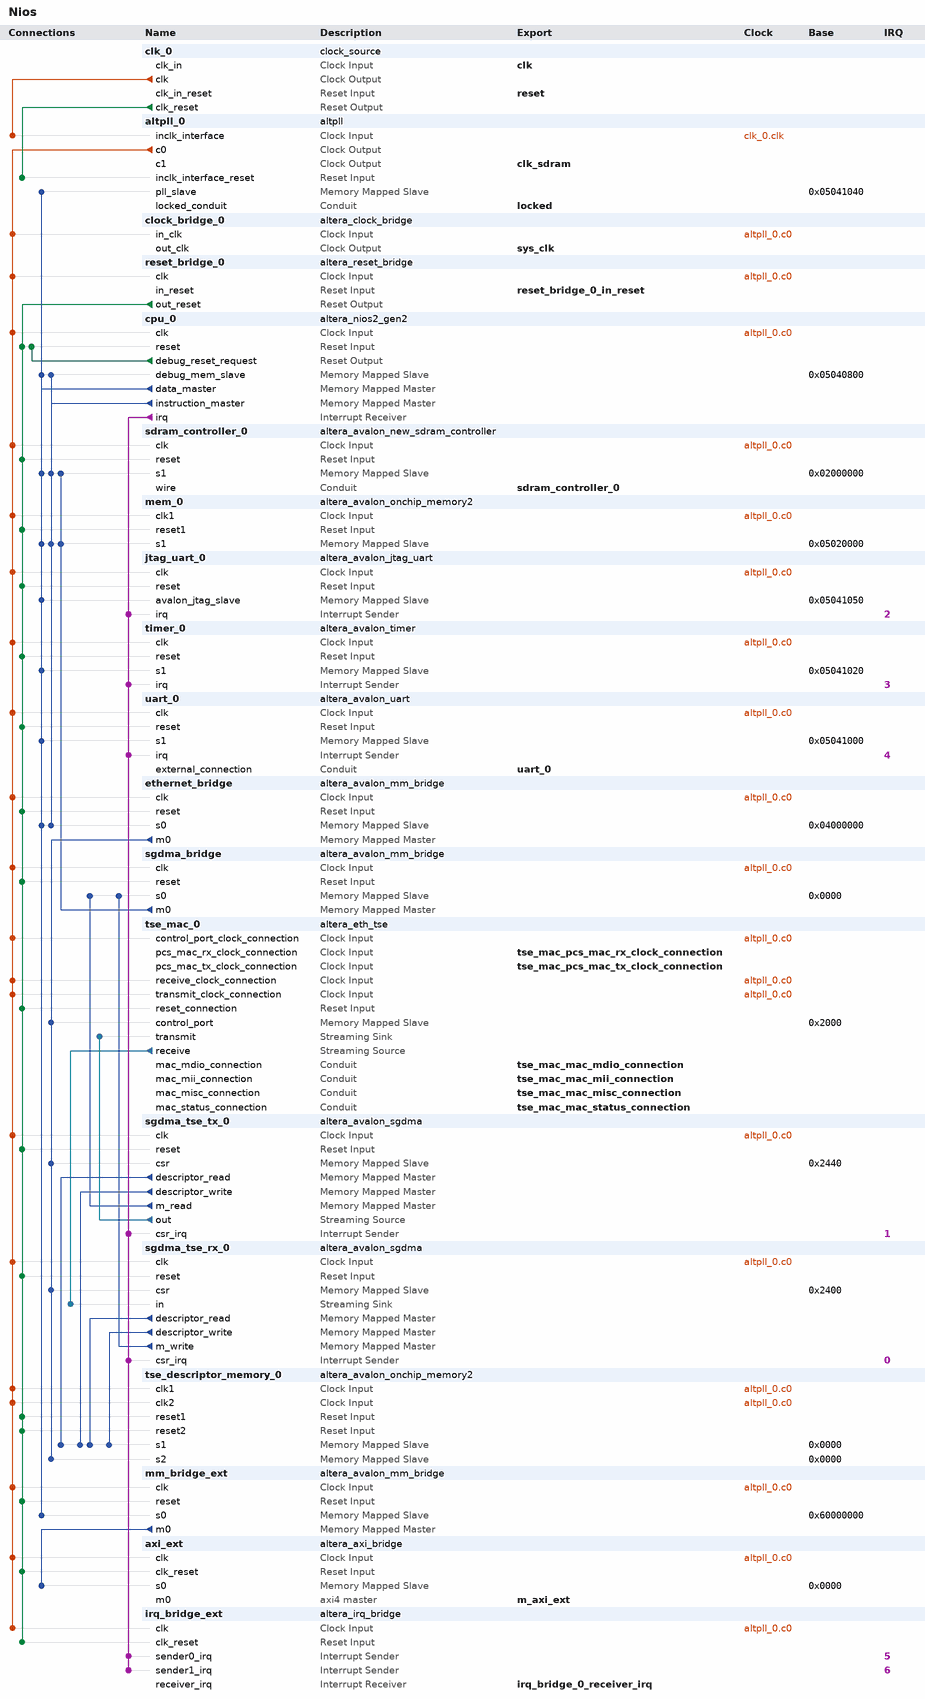
[diagram p0: system contents]
# Platform Designer (Qsys) system Nios, Cyclone 10 LP 10CL055YU484C8G
# Parameters at their usual value, and those the tool derives, are not listed.
package require -exact qsys 18.1
create_system Nios
set_project_property DEVICE_FAMILY {Cyclone 10 LP}
set_project_property DEVICE 10CL055YU484C8G

add_instance clk_0 clock_source 18.1
set_instance_parameter_value clk_0 clockFrequency 25000000

add_instance altpll_0 altpll 18.1
set_instance_parameter_value altpll_0 CLK0_DIVIDE_BY 1
set_instance_parameter_value altpll_0 CLK0_MULTIPLY_BY 4
set_instance_parameter_value altpll_0 CLK1_DIVIDE_BY 1
set_instance_parameter_value altpll_0 CLK1_DUTY_CYCLE 50
set_instance_parameter_value altpll_0 CLK1_MULTIPLY_BY 4
set_instance_parameter_value altpll_0 CLK1_PHASE_SHIFT -1500
set_instance_parameter_value altpll_0 CLK2_DIVIDE_BY 1
set_instance_parameter_value altpll_0 CLK2_DUTY_CYCLE 50
set_instance_parameter_value altpll_0 CLK2_MULTIPLY_BY 12
set_instance_parameter_value altpll_0 CLK2_PHASE_SHIFT 0
set_instance_parameter_value altpll_0 CLK3_DIVIDE_BY 1
set_instance_parameter_value altpll_0 CLK3_DUTY_CYCLE 50
set_instance_parameter_value altpll_0 CLK3_MULTIPLY_BY 2
set_instance_parameter_value altpll_0 CLK3_PHASE_SHIFT 0
set_instance_parameter_value altpll_0 INCLK0_INPUT_FREQUENCY 40000
set_instance_parameter_value altpll_0 PORT_ARESET PORT_UNUSED
set_instance_parameter_value altpll_0 PORT_LOCKED PORT_USED
set_instance_parameter_value altpll_0 PORT_clk1 PORT_USED
set_instance_parameter_value altpll_0 PORT_clk2 PORT_UNUSED
set_instance_parameter_value altpll_0 PORT_clk3 PORT_UNUSED

add_instance clock_bridge_0 altera_clock_bridge 18.1
set_instance_parameter_value clock_bridge_0 DERIVED_CLOCK_RATE 100000000
set_instance_parameter_value clock_bridge_0 EXPLICIT_CLOCK_RATE 0

add_instance reset_bridge_0 altera_reset_bridge 18.1
set_instance_parameter_value reset_bridge_0 ACTIVE_LOW_RESET 1
set_instance_parameter_value reset_bridge_0 SYNCHRONOUS_EDGES deassert

add_instance cpu_0 altera_nios2_gen2 18.1
set_instance_parameter_value cpu_0 dcache_size 0
set_instance_parameter_value cpu_0 debug_datatrigger 4
set_instance_parameter_value cpu_0 debug_hwbreakpoint 4
set_instance_parameter_value cpu_0 debug_traceType instruction_and_data_trace
set_instance_parameter_value cpu_0 exceptionSlave sdram_controller_0.s1
set_instance_parameter_value cpu_0 icache_size 16384
set_instance_parameter_value cpu_0 impl Fast
set_instance_parameter_value cpu_0 resetSlave sdram_controller_0.s1
set_instance_parameter_value cpu_0 setting_preciseIllegalMemAccessException true
set_instance_parameter_value cpu_0 setting_support31bitdcachebypass false

add_instance sdram_controller_0 altera_avalon_new_sdram_controller 18.1
set_instance_parameter_value sdram_controller_0 TAC 8.0
set_instance_parameter_value sdram_controller_0 TRCD 30.0
set_instance_parameter_value sdram_controller_0 TRFC 90.0
set_instance_parameter_value sdram_controller_0 TRP 30.0
set_instance_parameter_value sdram_controller_0 TWR 30.0
set_instance_parameter_value sdram_controller_0 casLatency 2
set_instance_parameter_value sdram_controller_0 columnWidth 9
set_instance_parameter_value sdram_controller_0 dataWidth 16
set_instance_parameter_value sdram_controller_0 generateSimulationModel false
set_instance_parameter_value sdram_controller_0 initRefreshCommands 8
set_instance_parameter_value sdram_controller_0 model single_Micron_MT48LC4M32B2_7_chip
set_instance_parameter_value sdram_controller_0 numberOfBanks 4
set_instance_parameter_value sdram_controller_0 numberOfChipSelects 1
set_instance_parameter_value sdram_controller_0 powerUpDelay 200.0
set_instance_parameter_value sdram_controller_0 refreshPeriod 7.8125
set_instance_parameter_value sdram_controller_0 rowWidth 13

add_instance mem_0 altera_avalon_onchip_memory2 18.1
set_instance_parameter_value mem_0 dataWidth 32
set_instance_parameter_value mem_0 dualPort false
set_instance_parameter_value mem_0 initMemContent true
set_instance_parameter_value mem_0 initializationFileName onchip_mem.hex
set_instance_parameter_value mem_0 memorySize 131072

add_instance jtag_uart_0 altera_avalon_jtag_uart 18.1
set_instance_parameter_value jtag_uart_0 simInteractiveOptions NO_INTERACTIVE_WINDOWS

add_instance timer_0 altera_avalon_timer 18.1
set_instance_parameter_value timer_0 period 1
set_instance_parameter_value timer_0 periodUnits MSEC

add_instance uart_0 altera_avalon_uart 18.1
set_instance_parameter_value uart_0 baud 115200
set_instance_parameter_value uart_0 dataBits 8
set_instance_parameter_value uart_0 fixedBaud true
set_instance_parameter_value uart_0 parity NONE
set_instance_parameter_value uart_0 stopBits 1

add_instance ethernet_bridge altera_avalon_mm_bridge 18.1
set_instance_parameter_value ethernet_bridge ADDRESS_UNITS SYMBOLS
set_instance_parameter_value ethernet_bridge ADDRESS_WIDTH 13
set_instance_parameter_value ethernet_bridge DATA_WIDTH 32
set_instance_parameter_value ethernet_bridge MAX_PENDING_RESPONSES 4
set_instance_parameter_value ethernet_bridge USE_AUTO_ADDRESS_WIDTH 1

add_instance sgdma_bridge altera_avalon_mm_bridge 18.1
set_instance_parameter_value sgdma_bridge ADDRESS_UNITS SYMBOLS
set_instance_parameter_value sgdma_bridge ADDRESS_WIDTH 26
set_instance_parameter_value sgdma_bridge DATA_WIDTH 32
set_instance_parameter_value sgdma_bridge MAX_PENDING_RESPONSES 4
set_instance_parameter_value sgdma_bridge USE_AUTO_ADDRESS_WIDTH 1

add_instance tse_mac_0 altera_eth_tse 18.1
set_instance_parameter_value tse_mac_0 XCVR_RCFG_JTAG_ENABLE 0
set_instance_parameter_value tse_mac_0 XCVR_SET_CAPABILITY_REG_ENABLE 0
set_instance_parameter_value tse_mac_0 XCVR_SET_CSR_SOFT_LOGIC_ENABLE 0
set_instance_parameter_value tse_mac_0 XCVR_SET_PRBS_SOFT_LOGIC_ENABLE 0
set_instance_parameter_value tse_mac_0 XCVR_SET_USER_IDENTIFIER 0
set_instance_parameter_value tse_mac_0 core_variation SMALL_MAC_10_100
set_instance_parameter_value tse_mac_0 eg_addr 12
set_instance_parameter_value tse_mac_0 enable_hd_logic true
set_instance_parameter_value tse_mac_0 enable_mac_flow_ctrl false
set_instance_parameter_value tse_mac_0 enable_magic_detect false
set_instance_parameter_value tse_mac_0 enable_shift16 true
set_instance_parameter_value tse_mac_0 ifGMII MII
set_instance_parameter_value tse_mac_0 ing_addr 12
set_instance_parameter_value tse_mac_0 mdio_clk_div 30
set_instance_parameter_value tse_mac_0 stat_cnt_ena false
set_instance_parameter_value tse_mac_0 transceiver_type NONE

add_instance sgdma_tse_tx_0 altera_avalon_sgdma 18.1
set_instance_parameter_value sgdma_tse_tx_0 enableBurstTransfers false
set_instance_parameter_value sgdma_tse_tx_0 enableUnalignedTransfers true
set_instance_parameter_value sgdma_tse_tx_0 readBlockDataWidth 32
set_instance_parameter_value sgdma_tse_tx_0 sinkErrorWidth 0
set_instance_parameter_value sgdma_tse_tx_0 sourceErrorWidth 1
set_instance_parameter_value sgdma_tse_tx_0 transferMode MEMORY_TO_STREAM
set_instance_parameter_value sgdma_tse_tx_0 writeBurstcountWidth 4

add_instance sgdma_tse_rx_0 altera_avalon_sgdma 18.1
set_instance_parameter_value sgdma_tse_rx_0 enableBurstTransfers false
set_instance_parameter_value sgdma_tse_rx_0 enableUnalignedTransfers false
set_instance_parameter_value sgdma_tse_rx_0 readBlockDataWidth 32
set_instance_parameter_value sgdma_tse_rx_0 sinkErrorWidth 6
set_instance_parameter_value sgdma_tse_rx_0 sourceErrorWidth 0
set_instance_parameter_value sgdma_tse_rx_0 transferMode STREAM_TO_MEMORY
set_instance_parameter_value sgdma_tse_rx_0 writeBurstcountWidth 4

add_instance tse_descriptor_memory_0 altera_avalon_onchip_memory2 18.1
set_instance_parameter_value tse_descriptor_memory_0 dataWidth 32
set_instance_parameter_value tse_descriptor_memory_0 dualPort true
set_instance_parameter_value tse_descriptor_memory_0 initMemContent true
set_instance_parameter_value tse_descriptor_memory_0 initializationFileName onchip_mem.hex
set_instance_parameter_value tse_descriptor_memory_0 memorySize 8192

add_instance mm_bridge_ext altera_avalon_mm_bridge 18.1
set_instance_parameter_value mm_bridge_ext ADDRESS_UNITS SYMBOLS
set_instance_parameter_value mm_bridge_ext ADDRESS_WIDTH 32
set_instance_parameter_value mm_bridge_ext DATA_WIDTH 32
set_instance_parameter_value mm_bridge_ext MAX_PENDING_RESPONSES 4
set_instance_parameter_value mm_bridge_ext USE_AUTO_ADDRESS_WIDTH 1

add_instance axi_ext altera_axi_bridge 18.1
set_instance_parameter_value axi_ext ADDR_WIDTH 28
set_instance_parameter_value axi_ext AXI_VERSION AXI4
set_instance_parameter_value axi_ext COMBINED_ACCEPTANCE_CAPABILITY 16
set_instance_parameter_value axi_ext COMBINED_ISSUING_CAPABILITY 16
set_instance_parameter_value axi_ext DATA_WIDTH 32
set_instance_parameter_value axi_ext M0_ID_WIDTH 18
set_instance_parameter_value axi_ext READ_ACCEPTANCE_CAPABILITY 16
set_instance_parameter_value axi_ext READ_ADDR_USER_WIDTH 32
set_instance_parameter_value axi_ext READ_DATA_REORDERING_DEPTH 1
set_instance_parameter_value axi_ext READ_DATA_USER_WIDTH 32
set_instance_parameter_value axi_ext READ_ISSUING_CAPABILITY 16
set_instance_parameter_value axi_ext S0_ID_WIDTH 8
set_instance_parameter_value axi_ext USE_M0_ARBURST 0
set_instance_parameter_value axi_ext USE_M0_ARCACHE 0
set_instance_parameter_value axi_ext USE_M0_ARID 0
set_instance_parameter_value axi_ext USE_M0_ARLEN 0
set_instance_parameter_value axi_ext USE_M0_ARLOCK 0
set_instance_parameter_value axi_ext USE_M0_ARQOS 0
set_instance_parameter_value axi_ext USE_M0_ARREGION 0
set_instance_parameter_value axi_ext USE_M0_ARSIZE 0
set_instance_parameter_value axi_ext USE_M0_ARUSER 0
set_instance_parameter_value axi_ext USE_M0_AWBURST 0
set_instance_parameter_value axi_ext USE_M0_AWCACHE 0
set_instance_parameter_value axi_ext USE_M0_AWID 0
set_instance_parameter_value axi_ext USE_M0_AWLEN 0
set_instance_parameter_value axi_ext USE_M0_AWLOCK 0
set_instance_parameter_value axi_ext USE_M0_AWQOS 0
set_instance_parameter_value axi_ext USE_M0_AWREGION 0
set_instance_parameter_value axi_ext USE_M0_AWSIZE 0
set_instance_parameter_value axi_ext USE_M0_AWUSER 0
set_instance_parameter_value axi_ext USE_M0_BID 0
set_instance_parameter_value axi_ext USE_M0_BRESP 1
set_instance_parameter_value axi_ext USE_M0_BUSER 0
set_instance_parameter_value axi_ext USE_M0_RID 0
set_instance_parameter_value axi_ext USE_M0_RLAST 0
set_instance_parameter_value axi_ext USE_M0_RRESP 1
set_instance_parameter_value axi_ext USE_M0_RUSER 0
set_instance_parameter_value axi_ext USE_M0_WSTRB 1
set_instance_parameter_value axi_ext USE_M0_WUSER 0
set_instance_parameter_value axi_ext USE_PIPELINE 1
set_instance_parameter_value axi_ext USE_S0_ARCACHE 0
set_instance_parameter_value axi_ext USE_S0_ARLOCK 0
set_instance_parameter_value axi_ext USE_S0_ARPROT 0
set_instance_parameter_value axi_ext USE_S0_ARQOS 0
set_instance_parameter_value axi_ext USE_S0_ARREGION 0
set_instance_parameter_value axi_ext USE_S0_ARUSER 0
set_instance_parameter_value axi_ext USE_S0_AWCACHE 0
set_instance_parameter_value axi_ext USE_S0_AWLOCK 0
set_instance_parameter_value axi_ext USE_S0_AWPROT 0
set_instance_parameter_value axi_ext USE_S0_AWQOS 0
set_instance_parameter_value axi_ext USE_S0_AWREGION 0
set_instance_parameter_value axi_ext USE_S0_AWUSER 0
set_instance_parameter_value axi_ext USE_S0_BRESP 1
set_instance_parameter_value axi_ext USE_S0_BUSER 0
set_instance_parameter_value axi_ext USE_S0_RRESP 1
set_instance_parameter_value axi_ext USE_S0_RUSER 0
set_instance_parameter_value axi_ext USE_S0_WLAST 0
set_instance_parameter_value axi_ext USE_S0_WUSER 0
set_instance_parameter_value axi_ext WRITE_ACCEPTANCE_CAPABILITY 16
set_instance_parameter_value axi_ext WRITE_ADDR_USER_WIDTH 32
set_instance_parameter_value axi_ext WRITE_DATA_USER_WIDTH 32
set_instance_parameter_value axi_ext WRITE_ISSUING_CAPABILITY 16
set_instance_parameter_value axi_ext WRITE_RESP_USER_WIDTH 32

add_instance irq_bridge_ext altera_irq_bridge 18.1
set_instance_parameter_value irq_bridge_ext IRQ_WIDTH 2

# connections
add_connection altpll_0.c0 axi_ext.clk clock
add_connection altpll_0.c0 clock_bridge_0.in_clk clock
add_connection altpll_0.c0 cpu_0.clk clock
add_connection altpll_0.c0 ethernet_bridge.clk clock
add_connection altpll_0.c0 irq_bridge_ext.clk clock
add_connection altpll_0.c0 jtag_uart_0.clk clock
add_connection altpll_0.c0 mem_0.clk1 clock
add_connection altpll_0.c0 mm_bridge_ext.clk clock
add_connection altpll_0.c0 reset_bridge_0.clk clock
add_connection altpll_0.c0 sdram_controller_0.clk clock
add_connection altpll_0.c0 sgdma_bridge.clk clock
add_connection altpll_0.c0 sgdma_tse_rx_0.clk clock
add_connection altpll_0.c0 sgdma_tse_tx_0.clk clock
add_connection altpll_0.c0 timer_0.clk clock
add_connection altpll_0.c0 tse_descriptor_memory_0.clk1 clock
add_connection altpll_0.c0 tse_descriptor_memory_0.clk2 clock
add_connection altpll_0.c0 tse_mac_0.control_port_clock_connection clock
add_connection altpll_0.c0 tse_mac_0.receive_clock_connection clock
add_connection altpll_0.c0 tse_mac_0.transmit_clock_connection clock
add_connection altpll_0.c0 uart_0.clk clock
add_connection clk_0.clk altpll_0.inclk_interface clock
add_connection clk_0.clk_reset altpll_0.inclk_interface_reset reset
add_connection cpu_0.debug_reset_request cpu_0.reset reset
add_connection reset_bridge_0.out_reset axi_ext.clk_reset reset
add_connection reset_bridge_0.out_reset cpu_0.reset reset
add_connection reset_bridge_0.out_reset ethernet_bridge.reset reset
add_connection reset_bridge_0.out_reset irq_bridge_ext.clk_reset reset
add_connection reset_bridge_0.out_reset jtag_uart_0.reset reset
add_connection reset_bridge_0.out_reset mem_0.reset1 reset
add_connection reset_bridge_0.out_reset mm_bridge_ext.reset reset
add_connection reset_bridge_0.out_reset sdram_controller_0.reset reset
add_connection reset_bridge_0.out_reset sgdma_bridge.reset reset
add_connection reset_bridge_0.out_reset sgdma_tse_rx_0.reset reset
add_connection reset_bridge_0.out_reset sgdma_tse_tx_0.reset reset
add_connection reset_bridge_0.out_reset timer_0.reset reset
add_connection reset_bridge_0.out_reset tse_descriptor_memory_0.reset1 reset
add_connection reset_bridge_0.out_reset tse_descriptor_memory_0.reset2 reset
add_connection reset_bridge_0.out_reset tse_mac_0.reset_connection reset
add_connection reset_bridge_0.out_reset uart_0.reset reset
add_connection cpu_0.data_master altpll_0.pll_slave avalon
set_connection_parameter_value cpu_0.data_master/altpll_0.pll_slave baseAddress 0x05041040
add_connection cpu_0.data_master cpu_0.debug_mem_slave avalon
set_connection_parameter_value cpu_0.data_master/cpu_0.debug_mem_slave baseAddress 0x05040800
add_connection cpu_0.data_master ethernet_bridge.s0 avalon
set_connection_parameter_value cpu_0.data_master/ethernet_bridge.s0 baseAddress 0x04000000
add_connection cpu_0.data_master jtag_uart_0.avalon_jtag_slave avalon
set_connection_parameter_value cpu_0.data_master/jtag_uart_0.avalon_jtag_slave baseAddress 0x05041050
add_connection cpu_0.data_master mem_0.s1 avalon
set_connection_parameter_value cpu_0.data_master/mem_0.s1 baseAddress 0x05020000
add_connection cpu_0.data_master mm_bridge_ext.s0 avalon
set_connection_parameter_value cpu_0.data_master/mm_bridge_ext.s0 baseAddress 0x60000000
add_connection cpu_0.data_master sdram_controller_0.s1 avalon
set_connection_parameter_value cpu_0.data_master/sdram_controller_0.s1 baseAddress 0x02000000
add_connection cpu_0.data_master timer_0.s1 avalon
set_connection_parameter_value cpu_0.data_master/timer_0.s1 baseAddress 0x05041020
add_connection cpu_0.data_master uart_0.s1 avalon
set_connection_parameter_value cpu_0.data_master/uart_0.s1 baseAddress 0x05041000
add_connection cpu_0.instruction_master cpu_0.debug_mem_slave avalon
set_connection_parameter_value cpu_0.instruction_master/cpu_0.debug_mem_slave baseAddress 0x05040800
add_connection cpu_0.instruction_master ethernet_bridge.s0 avalon
set_connection_parameter_value cpu_0.instruction_master/ethernet_bridge.s0 baseAddress 0x04000000
add_connection cpu_0.instruction_master mem_0.s1 avalon
set_connection_parameter_value cpu_0.instruction_master/mem_0.s1 baseAddress 0x05020000
add_connection cpu_0.instruction_master sdram_controller_0.s1 avalon
set_connection_parameter_value cpu_0.instruction_master/sdram_controller_0.s1 baseAddress 0x02000000
add_connection ethernet_bridge.m0 sgdma_tse_rx_0.csr avalon
set_connection_parameter_value ethernet_bridge.m0/sgdma_tse_rx_0.csr baseAddress 0x2400
add_connection ethernet_bridge.m0 sgdma_tse_tx_0.csr avalon
set_connection_parameter_value ethernet_bridge.m0/sgdma_tse_tx_0.csr baseAddress 0x2440
add_connection ethernet_bridge.m0 tse_descriptor_memory_0.s2 avalon
set_connection_parameter_value ethernet_bridge.m0/tse_descriptor_memory_0.s2 baseAddress 0x0000
add_connection ethernet_bridge.m0 tse_mac_0.control_port avalon
set_connection_parameter_value ethernet_bridge.m0/tse_mac_0.control_port baseAddress 0x2000
add_connection mm_bridge_ext.m0 axi_ext.s0 avalon
set_connection_parameter_value mm_bridge_ext.m0/axi_ext.s0 baseAddress 0x0000
add_connection sgdma_bridge.m0 mem_0.s1 avalon
set_connection_parameter_value sgdma_bridge.m0/mem_0.s1 baseAddress 0x05020000
add_connection sgdma_bridge.m0 sdram_controller_0.s1 avalon
set_connection_parameter_value sgdma_bridge.m0/sdram_controller_0.s1 baseAddress 0x02000000
add_connection sgdma_tse_rx_0.descriptor_read tse_descriptor_memory_0.s1 avalon
set_connection_parameter_value sgdma_tse_rx_0.descriptor_read/tse_descriptor_memory_0.s1 baseAddress 0x0000
add_connection sgdma_tse_rx_0.descriptor_write tse_descriptor_memory_0.s1 avalon
set_connection_parameter_value sgdma_tse_rx_0.descriptor_write/tse_descriptor_memory_0.s1 baseAddress 0x0000
add_connection sgdma_tse_rx_0.m_write sgdma_bridge.s0 avalon
set_connection_parameter_value sgdma_tse_rx_0.m_write/sgdma_bridge.s0 baseAddress 0x0000
add_connection sgdma_tse_tx_0.descriptor_read tse_descriptor_memory_0.s1 avalon
set_connection_parameter_value sgdma_tse_tx_0.descriptor_read/tse_descriptor_memory_0.s1 baseAddress 0x0000
add_connection sgdma_tse_tx_0.descriptor_write tse_descriptor_memory_0.s1 avalon
set_connection_parameter_value sgdma_tse_tx_0.descriptor_write/tse_descriptor_memory_0.s1 baseAddress 0x0000
add_connection sgdma_tse_tx_0.m_read sgdma_bridge.s0 avalon
set_connection_parameter_value sgdma_tse_tx_0.m_read/sgdma_bridge.s0 baseAddress 0x0000
add_connection sgdma_tse_tx_0.out tse_mac_0.transmit avalon_streaming
add_connection tse_mac_0.receive sgdma_tse_rx_0.in avalon_streaming
add_connection cpu_0.irq irq_bridge_ext.sender0_irq interrupt
set_connection_parameter_value cpu_0.irq/irq_bridge_ext.sender0_irq irqNumber 5
add_connection cpu_0.irq irq_bridge_ext.sender1_irq interrupt
set_connection_parameter_value cpu_0.irq/irq_bridge_ext.sender1_irq irqNumber 6
add_connection cpu_0.irq jtag_uart_0.irq interrupt
set_connection_parameter_value cpu_0.irq/jtag_uart_0.irq irqNumber 2
add_connection cpu_0.irq sgdma_tse_rx_0.csr_irq interrupt
set_connection_parameter_value cpu_0.irq/sgdma_tse_rx_0.csr_irq irqNumber 0
add_connection cpu_0.irq sgdma_tse_tx_0.csr_irq interrupt
set_connection_parameter_value cpu_0.irq/sgdma_tse_tx_0.csr_irq irqNumber 1
add_connection cpu_0.irq timer_0.irq interrupt
set_connection_parameter_value cpu_0.irq/timer_0.irq irqNumber 3
add_connection cpu_0.irq uart_0.irq interrupt
set_connection_parameter_value cpu_0.irq/uart_0.irq irqNumber 4

# exported interfaces
add_interface clk clock sink
set_interface_property clk EXPORT_OF clk_0.clk_in
add_interface clk_sdram clock source
set_interface_property clk_sdram EXPORT_OF altpll_0.c1
add_interface irq_bridge_0_receiver_irq interrupt receiver
set_interface_property irq_bridge_0_receiver_irq EXPORT_OF irq_bridge_ext.receiver_irq
add_interface locked conduit end
set_interface_property locked EXPORT_OF altpll_0.locked_conduit
add_interface m_axi_ext axi4 master
set_interface_property m_axi_ext EXPORT_OF axi_ext.m0
add_interface reset reset sink
set_interface_property reset EXPORT_OF clk_0.clk_in_reset
add_interface reset_bridge_0_in_reset reset sink
set_interface_property reset_bridge_0_in_reset EXPORT_OF reset_bridge_0.in_reset
add_interface sdram_controller_0 conduit end
set_interface_property sdram_controller_0 EXPORT_OF sdram_controller_0.wire
add_interface sys_clk clock source
set_interface_property sys_clk EXPORT_OF clock_bridge_0.out_clk
add_interface tse_mac_mac_mdio_connection conduit end
set_interface_property tse_mac_mac_mdio_connection EXPORT_OF tse_mac_0.mac_mdio_connection
add_interface tse_mac_mac_mii_connection conduit end
set_interface_property tse_mac_mac_mii_connection EXPORT_OF tse_mac_0.mac_mii_connection
add_interface tse_mac_mac_misc_connection conduit end
set_interface_property tse_mac_mac_misc_connection EXPORT_OF tse_mac_0.mac_misc_connection
add_interface tse_mac_mac_status_connection conduit end
set_interface_property tse_mac_mac_status_connection EXPORT_OF tse_mac_0.mac_status_connection
add_interface tse_mac_pcs_mac_rx_clock_connection clock sink
set_interface_property tse_mac_pcs_mac_rx_clock_connection EXPORT_OF tse_mac_0.pcs_mac_rx_clock_connection
add_interface tse_mac_pcs_mac_tx_clock_connection clock sink
set_interface_property tse_mac_pcs_mac_tx_clock_connection EXPORT_OF tse_mac_0.pcs_mac_tx_clock_connection
add_interface uart_0 conduit end
set_interface_property uart_0 EXPORT_OF uart_0.external_connection

set_interconnect_requirement {$system} qsys_mm.clockCrossingAdapter HANDSHAKE
set_interconnect_requirement {$system} qsys_mm.enableEccProtection FALSE
set_interconnect_requirement {$system} qsys_mm.insertDefaultSlave FALSE
set_interconnect_requirement {$system} qsys_mm.maxAdditionalLatency 1

save_system Nios.qsys
